# Altium schematic sheet Схема ЗУ.SchDoc
size 420 x 297 mm; Address1: Address1; Address2: Address2; Address3: Address3; Address4: Address4; DocumentNumber: https://t.me/arduino_viktori; SheetNumber: 1; SheetTotal: 1; Scale: 1:1; DocumentType: Схема электрическая принципиальная; FirstReferrence: АБВГ.123456.001
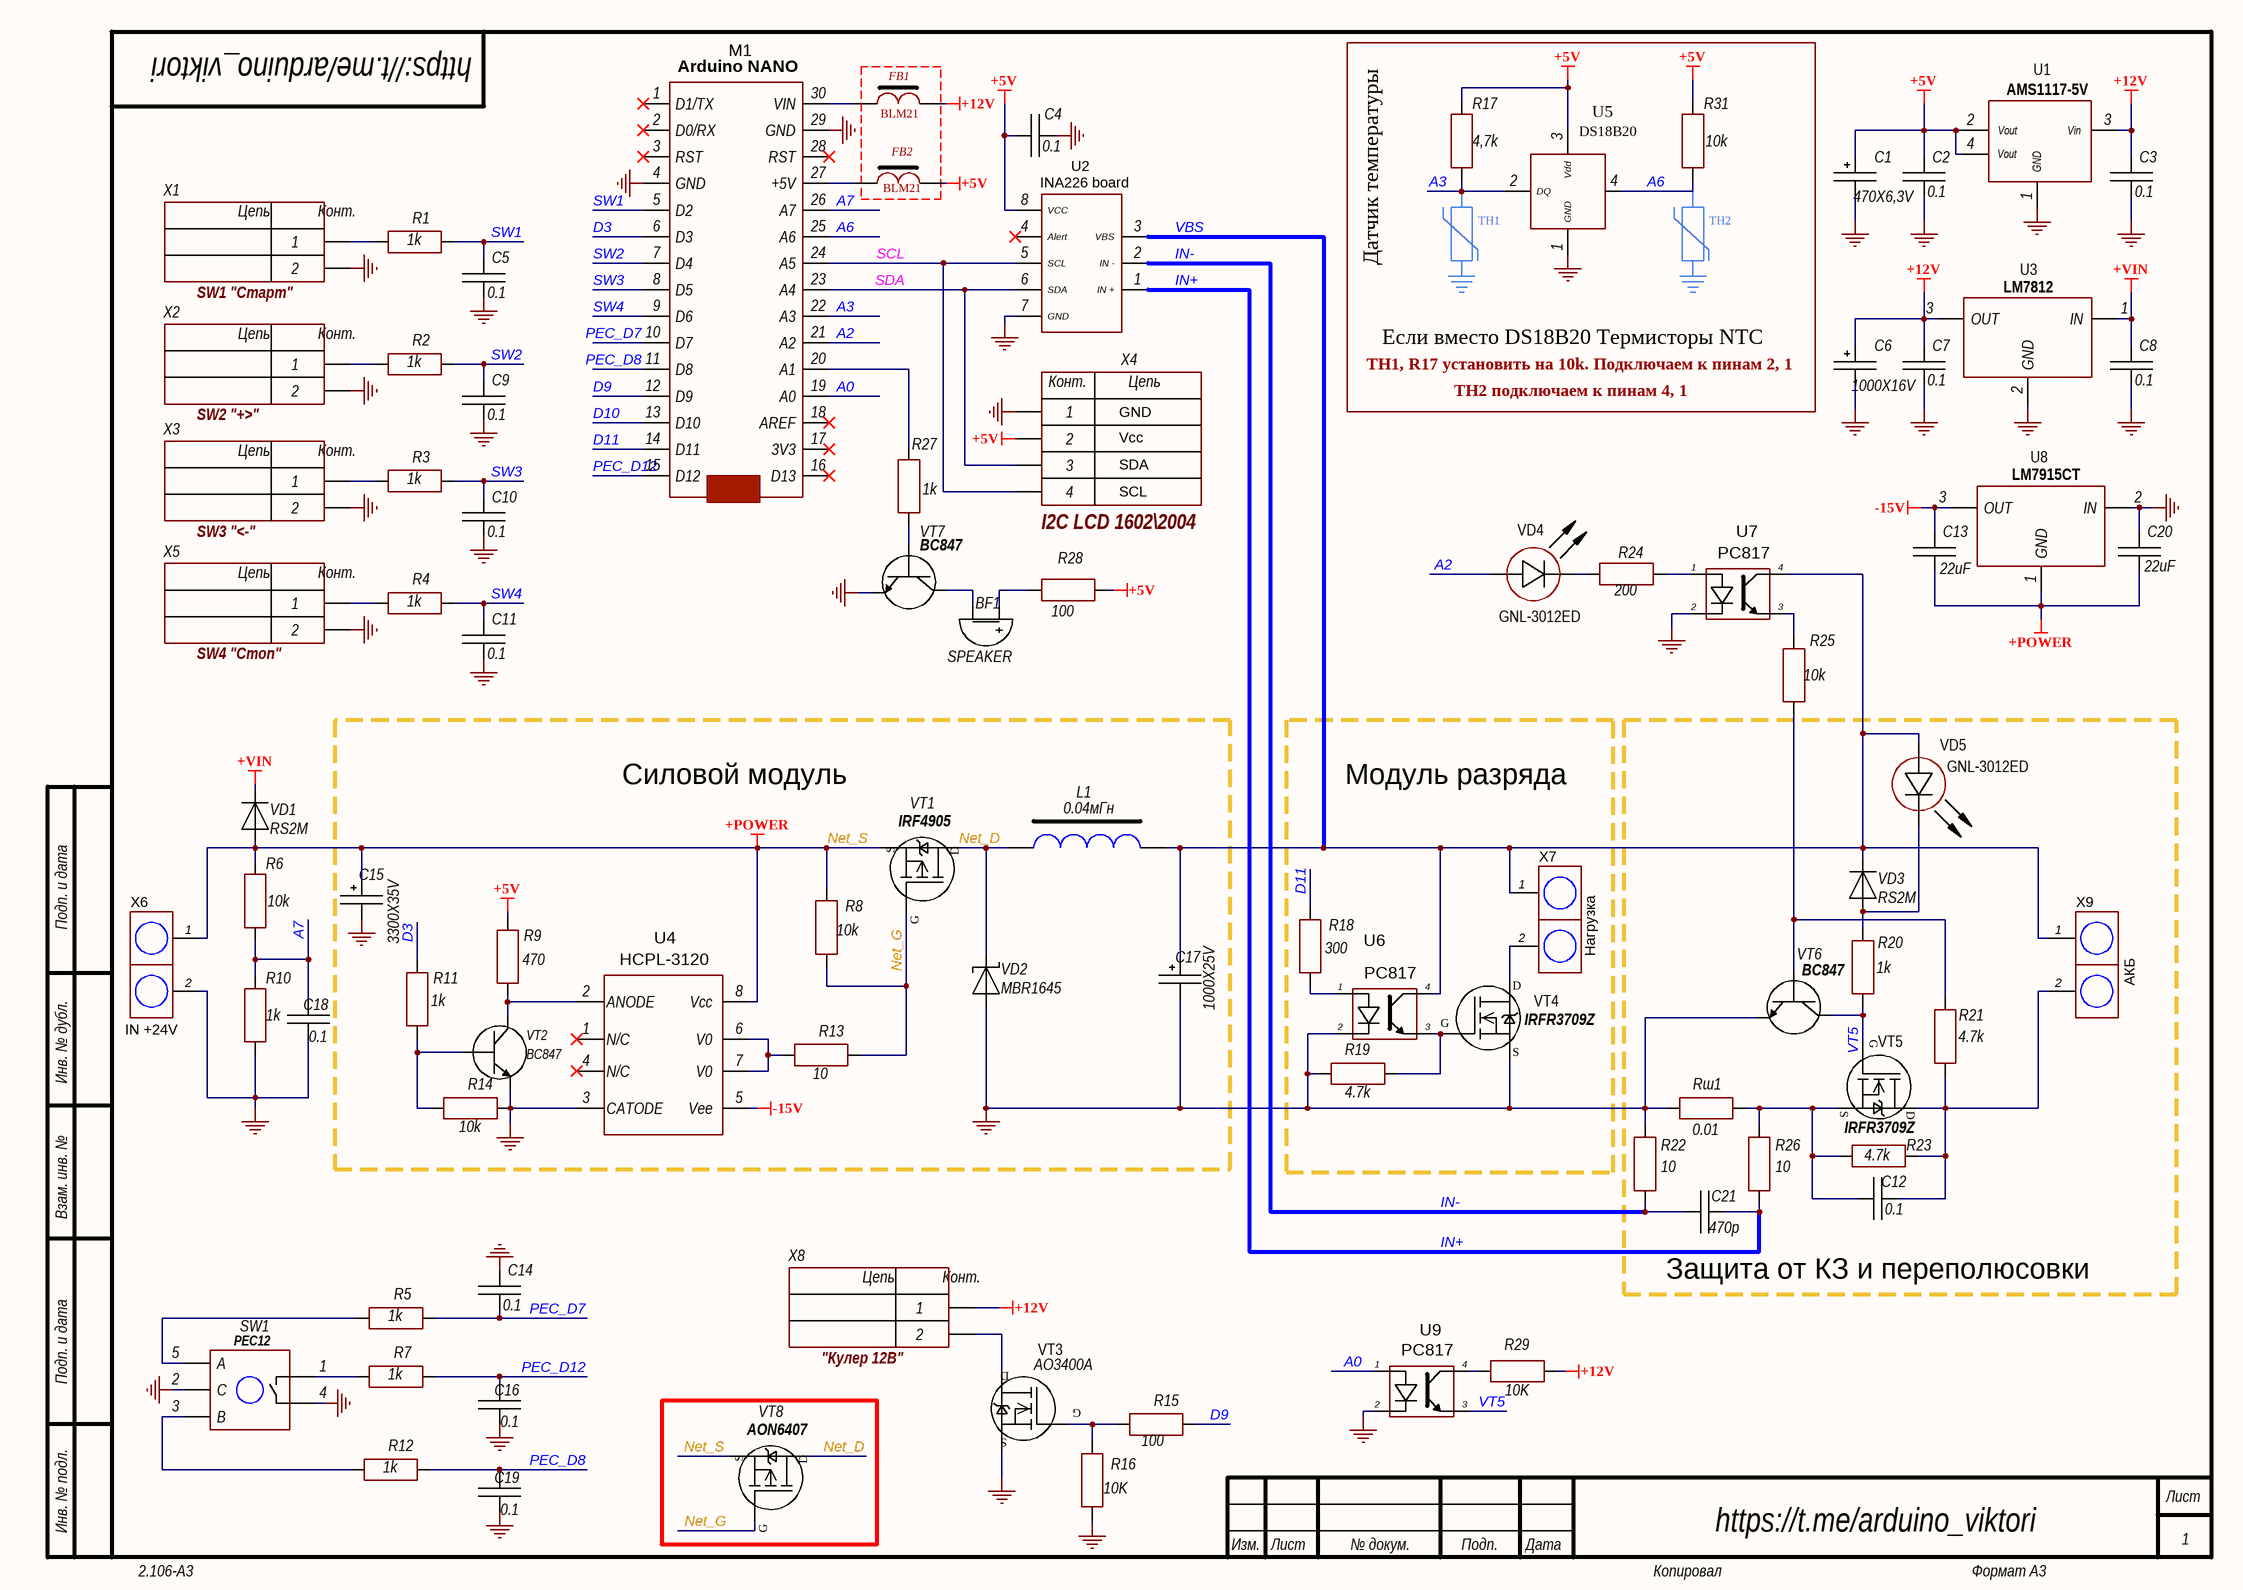
[diagram p0: Схема ЗУ.SchDoc]

## Parts
BF1  SPEAKER  [CON: CWF-2]
C1  470X6,3V  [D8C3.5H12]
C2  0.1  [CH0805C]
C3  0.1  [CH0805C]
C4  0.1  [CH0805C]
C5  0.1  [CH0805C]
C6  1000X16V  [D10C5H20]
C7  0.1  [CH0805C]
C8  0.1  [CH0805C]
C9  0.1  [CH0805C]
C10  0.1  [CH0805C]
C11  0.1  [CH0805C]
C12  0.1  [CH0805C]
C13  22uF  [CH1206C]
C14  0.1  [CH0805C]
C15  3300X35V  [D16C7.5H25]
C16  0.1  [CH0805C]
C17  1000X25V  [D10C5H20]
C18  0.1  [CH0805C]
C19  0.1  [CH0805C]
C20  22uF  [CH1206C]
C21  470p  [CH0805C]
FB1  BLM21  [CH0805L]
FB2  BLM21  [CH0805L]
L1  0.04мГн  [POWER_L]
M1  Arduino NANO  [ARDUINO NANA]
R1  1k  [CH0805R]
R2  1k  [CH0805R]
R3  1k  [CH0805R]
R4  1k  [CH0805R]
R5  1k  [CH0805R]
R6  10k  [CH0805R]
R7  1k  [CH0805R]
R8  10k  [CH0805R]
R9  470  [CH0805R]
R10  1k  [CH0805R]
R11  1k  [CH0805R]
R12  1k  [CH0805R]
R13  10  [CH0805R]
R14  10k  [CH0805R]
R15  100  [CH0805R]
R16  10K  [CH0805R]
R17  4,7k  [CH0805R]
R18  300  [CH0805R]
R19  4.7k  [CH0805R]
R20  1k  [CH0805R]
R21  4.7k  [CH0805R]
R22  10  [CH0805R]
R23  4.7k  [CH0805R]
R24  200  [CH0805R]
R25  10k  [CH0805R]
R26  10  [CH0805R]
R27  1k  [CH0805R]
R28  100  [CH0805R]
R29  10K  [CH0805R]
R31  10k  [CH0805R]
Rш1  0.01  [HUNT 10mm]
SW1  PEC12  [CON: CWF-5]
U1  AMS1117-5V  [SOT223]
U2  INA226 board  [CON: PBS-8]
U3  LM7812  [TO220_123]
U4  HCPL-3120  [DIP-8]
U5  DS18B20  [CON: PLS-4]
U6  PC817  [PC817-SMD]
U7  PC817  [PC817-SMD]
U8  LM7915CT  [TO-220_90]
U9  PC817  [PC817-SMD]
VD1  RS2M  [SMB]
VD2  MBR1645  [TO-220_2pin]
VD3  RS2M  [SMB]
VD4  GNL-3012ED  [DIOD: LED5MM_R]
VD5  GNL-3012ED  [DIOD: LED5MM_R]
VT1  IRF4905  [TO220_123_V]
VT2  BC847  [SOT23_123]
VT3  AO3400A  [SOT23_132]
VT4  IRFR3709Z  [D2PAK]
VT5  IRFR3709Z  [D2PAK]
VT6  BC847  [SOT23_123]
VT7  BC847  [SOT23_123]
VT8  AON6407  [DFN5x6]
X1  SW1 "Старт"  [CON: CWF-2]
X2  SW2 "+>"  [CON: CWF-2]
X3  SW3 "<-"  [CON: CWF-2]
X4  I2C LCD 1602\2004  [CON: CWF-4]
X5  SW4 "Стоп"  [CON: CWF-2]
X6  IN +24V  [CON: 2P_5mm]
X7  Нагрузка  [CON: 2P_5mm]
X8  "Кулер 12В"  [CON: CWF-2]
X9  АКБ  [CON: 2P_5mm]

## Blocks framed on the sheet
Силовой модуль: C15 C17 L1 R8 R9 R11 R13 R14 U4 VD2 VT1 VT2
Модуль разряда: R18 R19 U6 VT4 X7
Защита от КЗ и переполюсовки: C12 C21 R20-R23 R26 Rш1 VD3 VD5 VT5 VT6 X9

## Nets
+5V: C1.1 C2.1 C4.2 FB2.2 R9.2 R17.2 R28.1 R31.2 U1.2(Vout) U1.4(Vout) U2.8(VCC) U5.3(Vdd) X4.2
+12V: C3.1 C6.1 C7.1 FB1.2 R29.1 U1.3(Vin) U3.3(OUT) X8.1
+VIN: C8.1 U3.1(IN) VD1.2
-15V: C13.1 U4.5(Vee) U8.3(OUT)
GND: C1.2 C2.2 C3.2 C4.1 C5.1 C6.2 C7.2 C8.2 C9.1 C10.1 C11.1 C14.2 C15.2 C16.2 C17.2 C18.2 C19.2 C20.1 M1.4(GND) M1.29(GND) R10.1 R14.2 R16.1 R19.2 R22.1 Rш1.2 SW1.2(C) SW1.4 U1.1(GND) U2.7(GND) U3.2(GND) U4.3(CATODE) U5.1(GND) U6.2 U7.2 U8.2(IN) U9.2 VD2.2 VT2.3(E) VT3.2(Исток) VT4.3(Исток) VT6.3(E) VT7.3(E) X1.2 X2.2 X3.2 X4.1 X5.2 X6.2
Net_S: C13.2 C15.1 C20.2 R6.2 R8.2 U4.8(Vcc) U8.1(GND) VD1.1 VT1.3(Исток) VT8.3(Исток) X6.1  [also labelled +POWER]
A0: M1.19(A0) U9.1
A2: M1.21(A2) VD4.1(A)
A3: M1.22(A3) R17.1 U5.2(DQ)
A6: M1.25(A6) R31.1 U5.4(DQ)
A7: C18.1 M1.26(A7) R6.1 R10.2
D3: M1.6(D3) R11.2
D9: M1.12(D9) R15.2
D10: M1.13(D10)
D11: M1.14(D11) R18.2
IN+: C21.1 R26.2 U2.1(IN_+)
IN-: C21.2 R22.2 U2.2(IN_-)
Net_D: L1.1 VD2.1 VT1.2(Сток) VT8.2(Сток)
Net_G: R8.1 R13.2 VT1.1(Затвор(Gate)) VT8.1(Затвор(Gate))
PEC_D7: C14.1 M1.10(D7) R5.2
PEC_D8: C19.1 M1.11(D8) R12.2
PEC_D12: C16.1 M1.15(D12) R7.2
SCL: M1.24(A5) U2.5(SCL) X4.4
SDA: M1.23(A4) U2.6(SDA) X4.3
SW1: C5.2 M1.5(D2) R1.2
SW2: C9.2 M1.7(D4) R2.2
SW3: C10.2 M1.8(D5) R3.2
SW4: C11.2 M1.9(D6) R4.2
VBS: C17.1 L1.2 U2.3(VBS) U6.4 U7.4 VD3.2 VD5.1(A) X7.1 X9.1
VT5: R20.2 U9.3 VT5.1(Затвор) VT6.2(C)
NetBF1_1: BF1.1(+) R28.2
NetBF1_2: BF1.2(-) VT7.2(C)
NetC12_1: C12.1 R23.2 R26.1 Rш1.1 VT5.3(Исток)
NetC12_2: C12.2 R21.2 R23.1 VT5.2(Сток) X9.2
NetFB1_1: FB1.1 M1.30(VIN)
NetFB2_1: FB2.1 M1.27(+5V)
NetM1_20: M1.20(A1) R27.2
NetR1_1: R1.1 X1.1
NetR2_1: R2.1 X2.1
NetR3_1: R3.1 X3.1
NetR4_1: R4.1 X5.1
NetR5_1: R5.1 SW1.5(A)
NetR7_1: R7.1 SW1.1
NetR9_1: R9.1 U4.2(ANODE) VT2.2(C)
NetR11_1: R11.1 R14.1 VT2.1(B)
NetR12_1: R12.1 SW1.3(B)
NetR13_1: R13.1 U4.6(V0) U4.7(V0)
NetR15_1: R15.1 R16.2 VT3.1(Затвор)
NetR18_1: R18.1 U6.1
NetR19_1: R19.1 U6.3 VT4.1(Затвор)
NetR20_1: R20.1 VD3.1 VD5.2(C)
NetR21_1: R21.1 R25.2 VT6.1(B)
NetR24_1: R24.1 VD4.2(C)
NetR24_2: R24.2 U7.1
NetR25_1: R25.1 U7.3
NetR27_1: R27.1 VT7.1(B)
NetR29_2: R29.2 U9.4
NetVT3_3: VT3.3(Сток) X8.2
NetVT4_2: VT4.2(Сток) X7.2

Not connected (* = marked no-connect by the designer): M1 1(D1/TX)* 2(D0/RX)* 3(RST)* 16(D13)* 17(3V3)* 18(AREF)* 28(RST)*; U2 4(Alert)*; U4 1(N/C)* 4(N/C)*

## Notes on the sheet
- Датчик температуры
- TH1
- (near R31) TH2
- TH1, R17 установить на 10k. Подключаем к пинам 2, 1
- Если вместо DS18B20 Термисторы NTC
- TH2 подключаем к пинам 4, 1
- GND
- Vcc
- SDA
- SCL
- Подп. и дата
- Инв. № дубл.
- Взам. инв. №
- Инв. № подл.
- Изм.
- Лист
- № докум.
- Подп.
- Дата
- 2.106-A3
- Копировал
- Формат А3
- (in symbol 2-Connector) Цепь; Конт.
- (in symbol 4-Connector) Конт.; Цепь
- (in symbol N-KANAL) D; G; S
- (in symbol P-KANAL) S; D; G

## Library data of the parts
BF1 = Buzzer: Manufacturer: PUI Audio, Inc.; Model: AI-1223-TWT-3V-2-R; HelpURL: https://www.digikey.com/product-detail/en/pui-audio-inc/AI-1223-TWT-3V-2-R/668-1456-ND/5011391; ComponentKind: Internally Driven
C1 C6 C15 C17 = AlumCap: Manufacturer: *; Model: *; HelpURL: *; ComponentKind: *; Value: *
C2-C5 C7-C14 C16 C18-C21 = Capacitor: Manufacturer: *; Model: *; HelpURL: *; ComponentKind: *; Value: *
FB1 FB2 = FB-1
L1 = TRANS
R1-R29 R31 Rш1 = Resistor: Manufacturer: *; Model: *; HelpURL: *; ComponentKind: *; Value: *
SW1 = PEC12: Encoder; Model: *; Manufacturer: *; HelpURL: *; ComponentKind: *
U1 = AMS117
U2 = INA226
U3 U8 = 7809
U5 = DS18B20_V1
VD1 VD3 = Diod: ComponentKind: *; Manufacturer: *; Model: *; HelpURL: *
VD2 = Diod Schottky: ComponentKind: *; Manufacturer: *; Model: *; HelpURL: *
VD4 VD5 = LED
VT1 VT8 = P-KANAL
VT2 VT6 VT7 = N-P-N
VT3-VT5 = N-KANAL
X1-X3 X5 X8 = 2-Connector: Model: *; Manufacturer: *; HelpURL: *; ComponentKind: *
X4 = 4-Connector: Model: *; Manufacturer: *; HelpURL: *; ComponentKind: *
X6 X7 X9 = 2-CON